# EAGLE design LDR v1 (EAGLE 9.7.0)
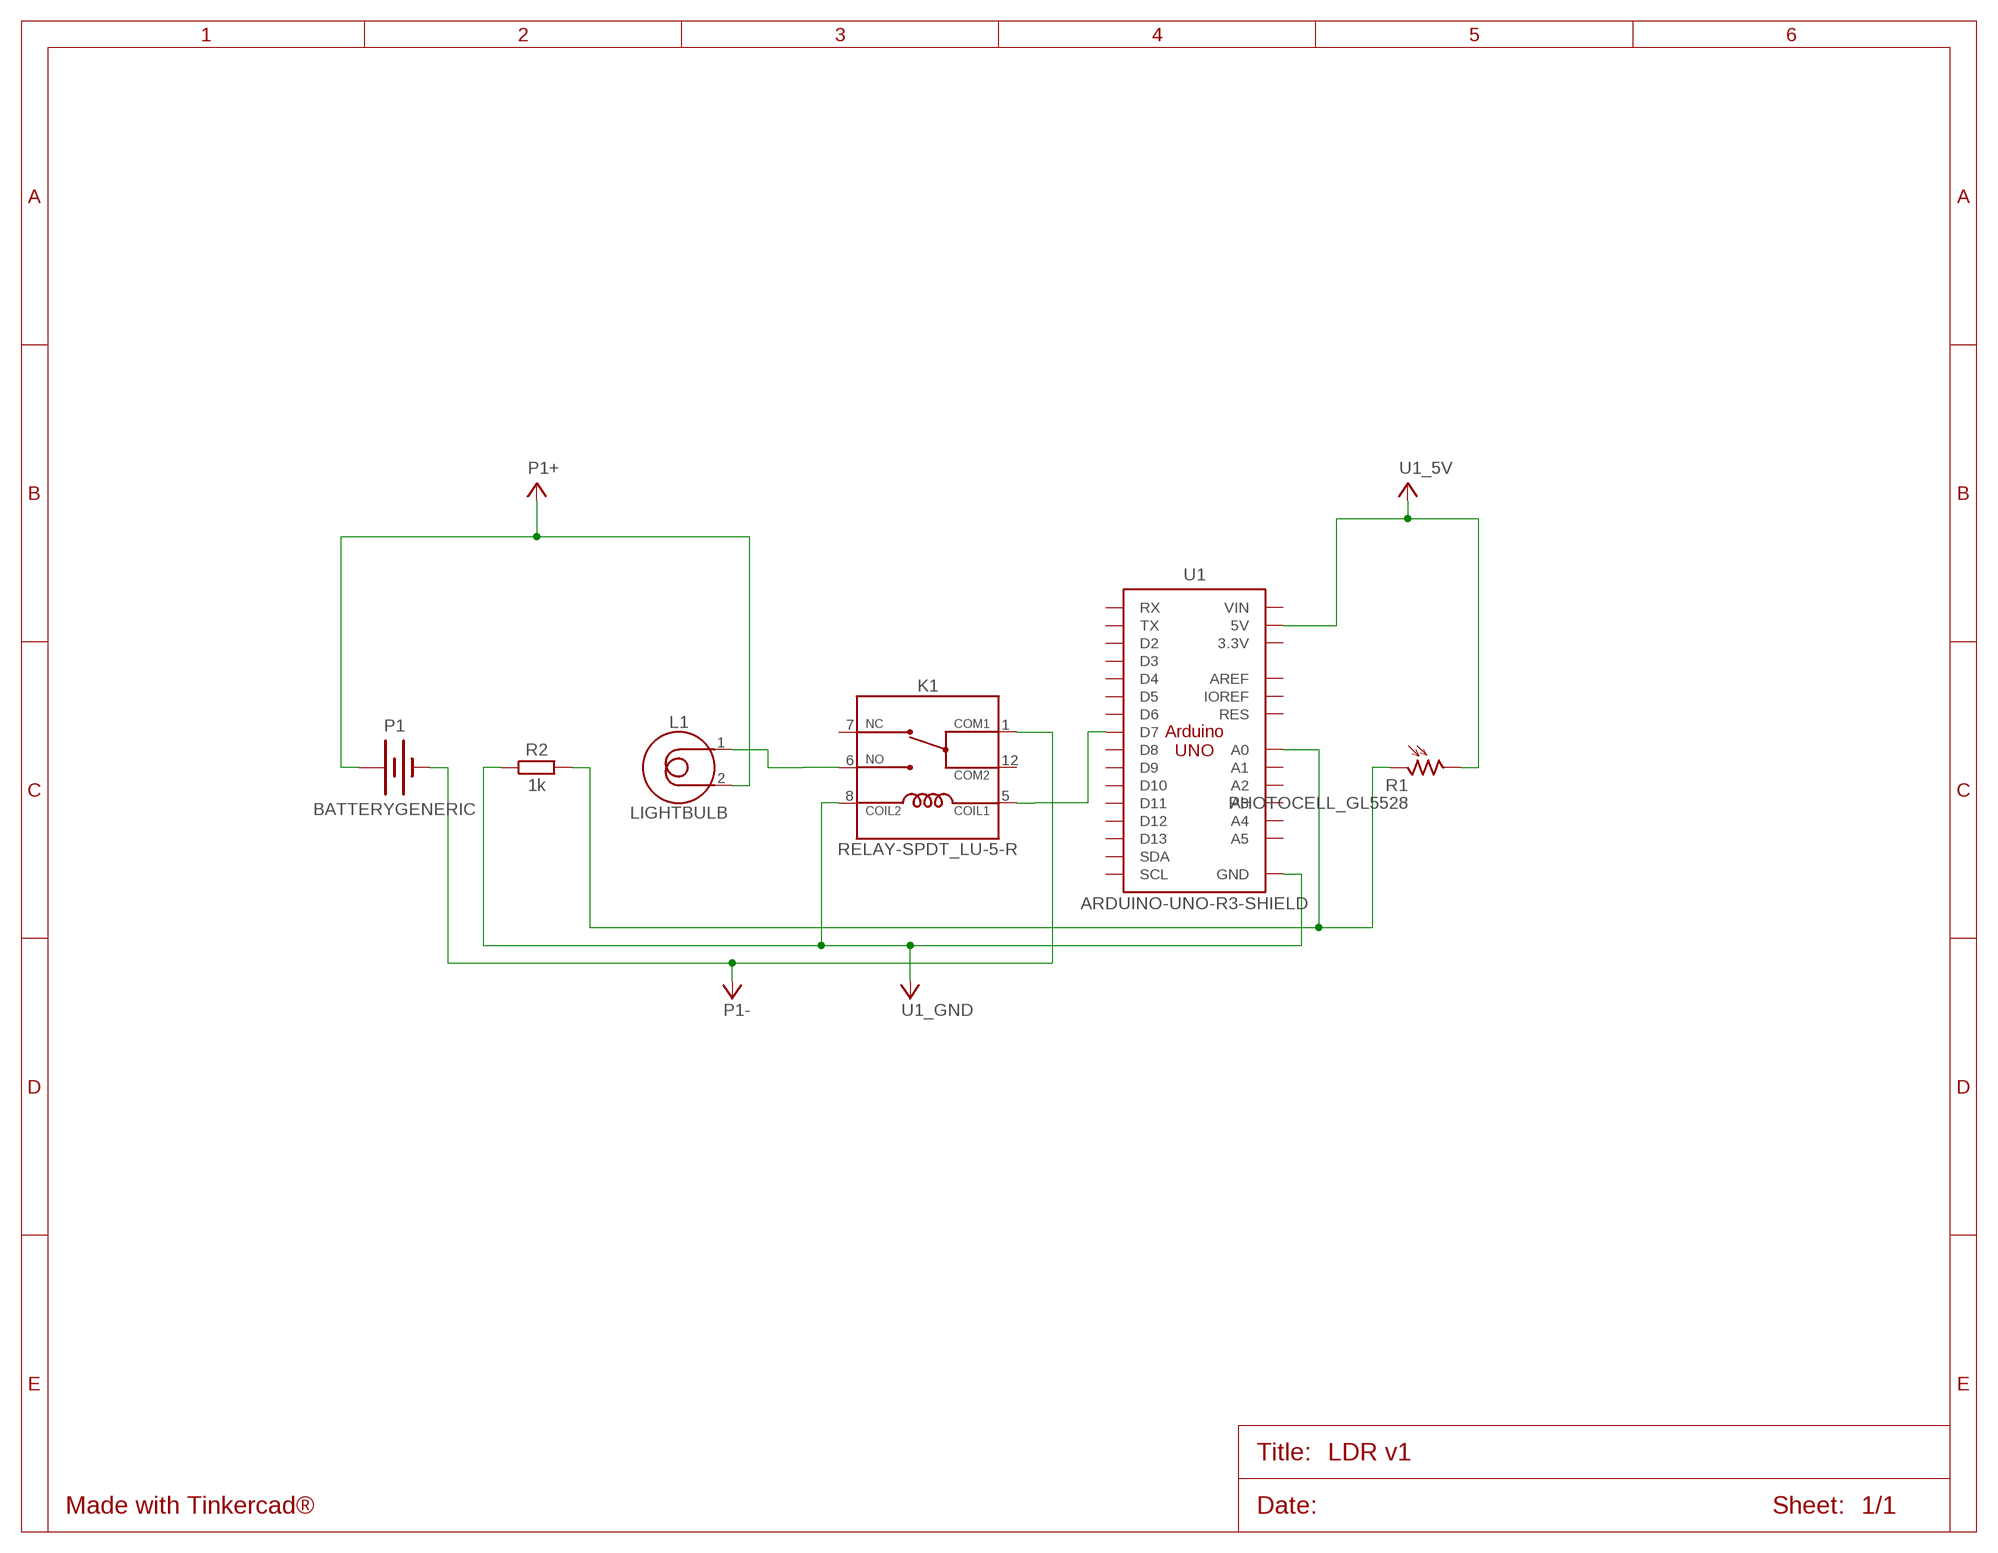
[diagram p0: schematic, sheet 1]

## Parts
K1  RELAY-SPDT_LU-5-R  [LU-5-R]
L1  LIGHTBULB  [1X02]
P1  BATTERYGENERIC  [BATTERY-GENERIC]
R1  PHOTOCELL_GL5528  [GL5528]
R2  1k  RESISTOR_AXIAL-10.16MM-PITCH  [RESAD1016W63L850D250B]
U1  ARDUINO-UNO-R3-SHIELD  [ARDUINO-UNO-R3-SHIELD]

## Nets
L1_1: K1.6(NO) L1.1
P1+: L1.2 P1.+
P1-: K1.1(COM1) P1.-
U1_5V: R1.2 U1.5V
U1_A0: R1.1 R2.2 U1.A0
U1_D7: K1.5(COIL1) U1.D7
U1_GND: K1.8(COIL2) R2.1 U1.GND@0(GND) U1.GND@1(GND) U1.GND@2(GND)
Unconnected: K1.7(NC) K1.12(COM2) U1.3.3V U1.A1 U1.A2 U1.A3 U1.A4 U1.A5 U1.AREF U1.D2 U1.D3 U1.D4 U1.D5 U1.D6 U1.D8 U1.D9 U1.D10 U1.D11 U1.D12 U1.D13 U1.IOREF U1.RES U1.RX U1.SCL U1.SDA U1.TX U1.VIN

## Library data of the parts
K1 = Tinkercad:RELAY-SPDT
L1 = Tinkercad:LIGHTBULB
P1 = Tinkercad:BATTERY
R1 = Tinkercad:PHOTOCELL: Photoresistor / Photoconductive cells Reference Datasheet <https://www.sunrom.com/get/753444>
R2 = Tinkercad:RESISTOR: Resistor Fixed - Generic
U1 = Tinkercad:ARDUINO-UNO-R3-SHIELD

## Board
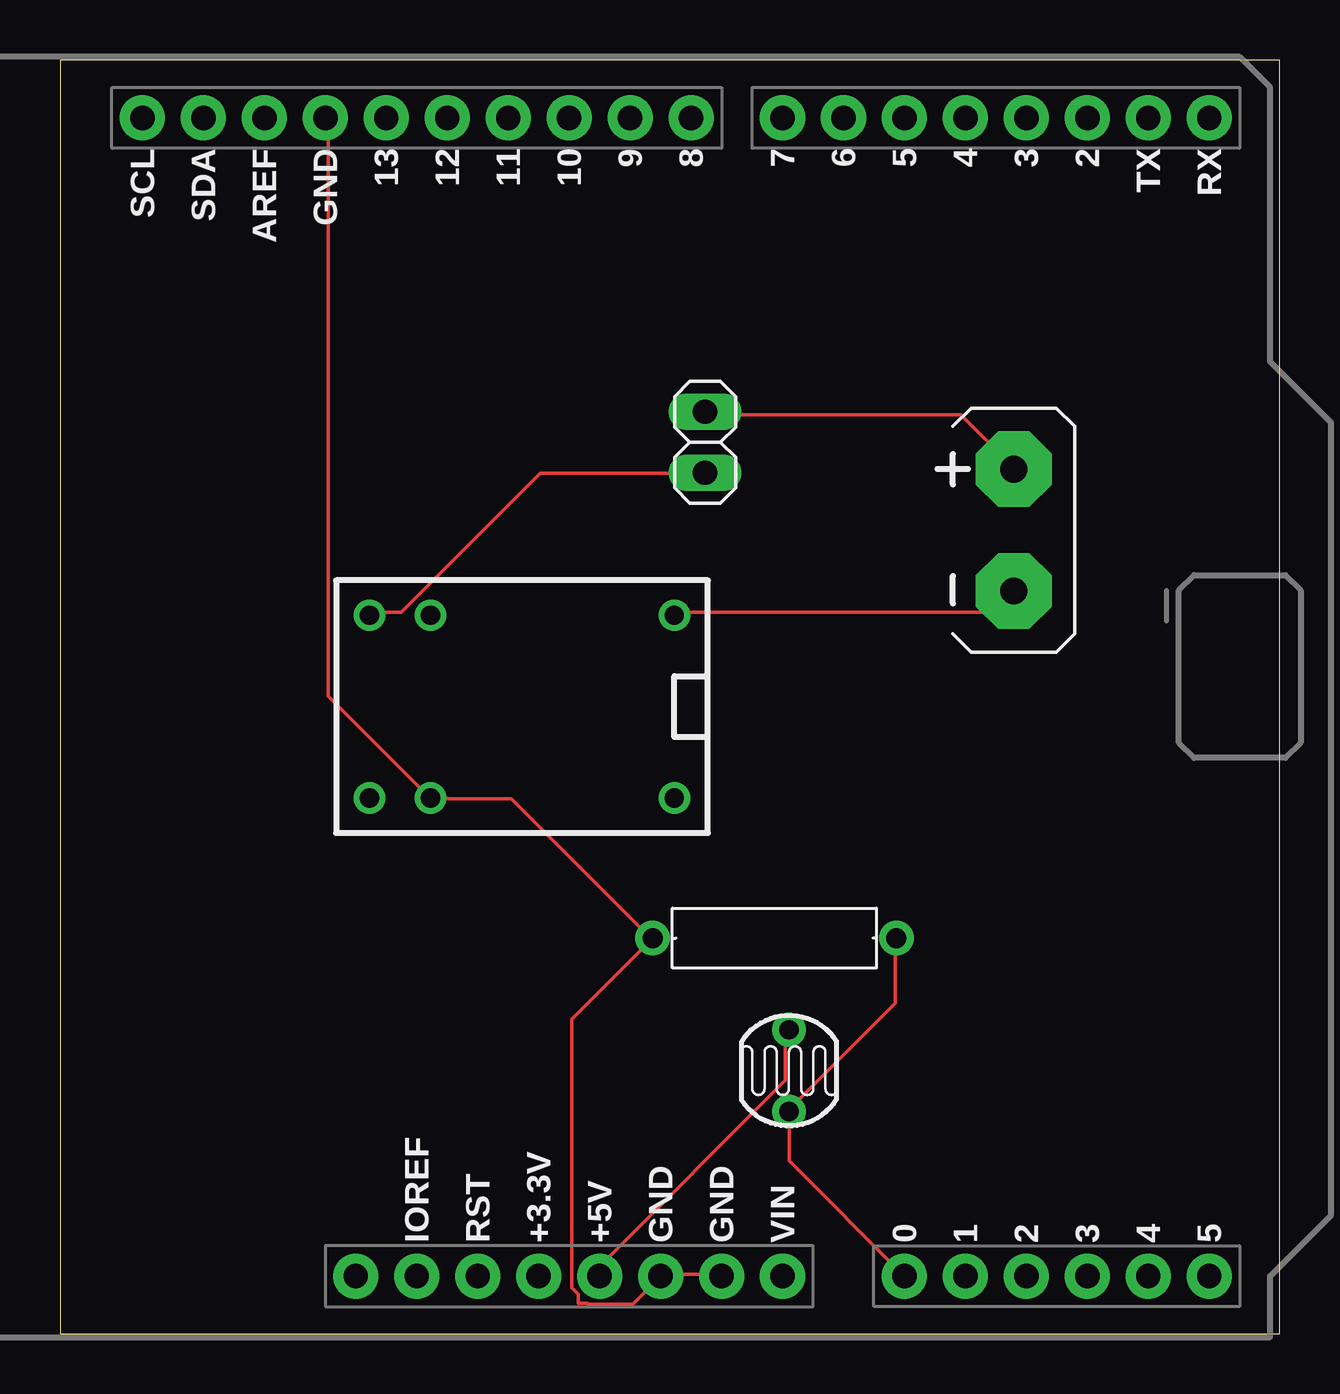
[diagram p1: board, top side]
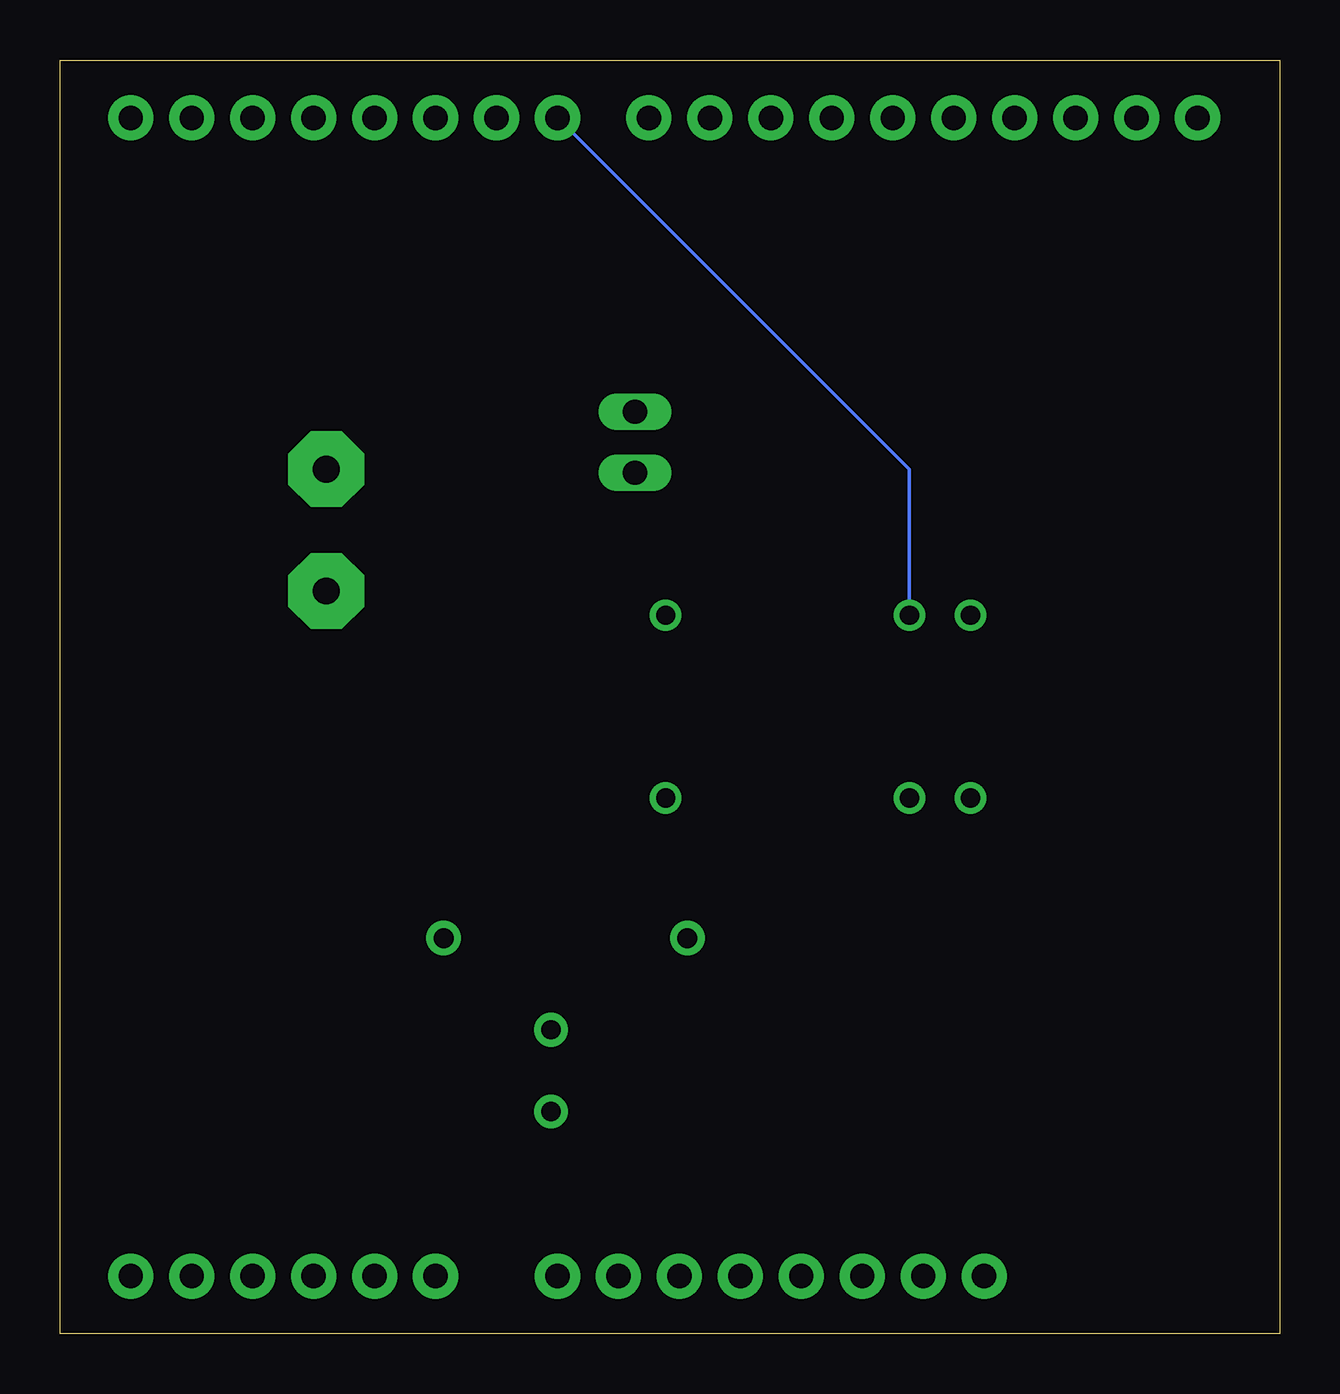
[diagram p2: board, bottom side, seen from below]

Size 50.83 x 53.08 mm. Coordinates in mm from the lower left corner, seen from the top.
Outline: 0,0 50.83,0 50.83,53.08 0,53.08 0,0
Copper layers (1*16): Top 0.035mm / dielectric 1.5mm / Bottom 0.035mm
Design rules "default": minimum track width 6mil, minimum drill 0.35mm, track to track 6mil, track to pad 6mil, pad to pad 6mil, via to via 6mil, smd to smd 6mil, copper to edge 40mil, drill to drill 6mil, minimum pad ring 10mil, minimum via ring 8mil, stop-mask expansion 4mil, vias tented up to drill 0mil, thermal gap 10mil

### Footprints (pad centres in the part's own frame; a part is rotated, then mirrored left to right if it is on the bottom)
LU-5-R = drill 0.8: 1 -6.35,-3.81; 5 3.81,-3.81; 6 6.35,-3.81; 7 6.35,3.81; 8 3.81,3.81; 12 -6.35,3.81
1X02 = drill 1.016 long: 1 -1.27,0; 2 1.27,0
BATTERY-GENERIC = drill 1.118 pad 3.15 octagon: + 2.54,0; - -2.54,0
GL5528 = drill 0.8 pad 1.4: 1 -1.702,0; 2 1.702,0
RESAD1016W63L850D250B = drill 0.83 pad 1.43: 1 -5.08,0; 2 5.08,0
ARDUINO-UNO-R3-SHIELD = drill 1.016 pad 1.88: 3.3V 24.13,-2.54; 5V 24.13,0; A0 24.13,12.7; A1 24.13,15.24; A2 24.13,17.78; A3 24.13,20.32; A4 24.13,22.86; A5 24.13,25.4; AREF -24.13,-13.97; D2 -24.13,20.32; D3 -24.13,17.78; D4 -24.13,15.24; D5 -24.13,12.7; D6 -24.13,10.16; D7 -24.13,7.62; D8 -24.13,3.81; D9 -24.13,1.27; D10 -24.13,-1.27; D11 -24.13,-3.81; D12 -24.13,-6.35; D13 -24.13,-8.89; GND@0 24.13,2.54; GND@1 24.13,5.08; GND@2 -24.13,-11.43; IOREF 24.13,-7.62; NC 24.13,-10.16; RES 24.13,-5.08; RX -24.13,25.4; SCL -24.13,-19.05; SDA -24.13,-16.51; TX -24.13,22.86; VIN 24.13,7.62

### Placement (x,y rotation side)
K1  19.25,26.13 180 top
L1  26.88,37.15 90 top
P1  39.74,33.49 90 top
R1  30.37,10.97 90 top
R2  29.77,16.49 0 top
U1  22.48,26.54 270 top

### Tracks (layer width: path | path; a pad name or v marks a point on that pad's centre or on a via)
L1_1
  Top 0.152: K1.6 13.01,30.07 14.22,30.07 20.02,35.86 26.87,35.86 L1.1
P1+
  Top 0.152: L1.2 27.03,38.3 37.54,38.3 39.68,36.17 P1.+
P1-
  Top 0.152: K1.1 25.65,30.07 38.91,30.07 39.68,30.84 P1.-
U1_5V
  Top 0.152: R1.2 30.23,12.55 30.23,10.57 22.61,2.95 22.61,2.49 U1.5V
U1_A0
  Top 0.152: U1.A0 35.1,2.49 30.38,7.21 30.38,9.2 R1.1 30.38,9.35 34.8,13.77 34.8,16.36 R2.2
U1_D7
  Bottom 0.152: K1.5 15.44,30.07 15.44,36.02 30.07,50.65 U1.D7
U1_GND
  Top 0.152: U1.GND@1 27.48,2.49 25.04,2.49 U1.GND@0 23.86,1.24 22,1.24 21.97,1.27 21.59,1.27 21.59,1.65 21.32,1.92 21.32,13.12 R2.1 24.59,16.51 18.8,22.3 15.44,22.3 K1.8 15.29,22.45 11.18,26.57 11.18,50.65 U1.GND@2